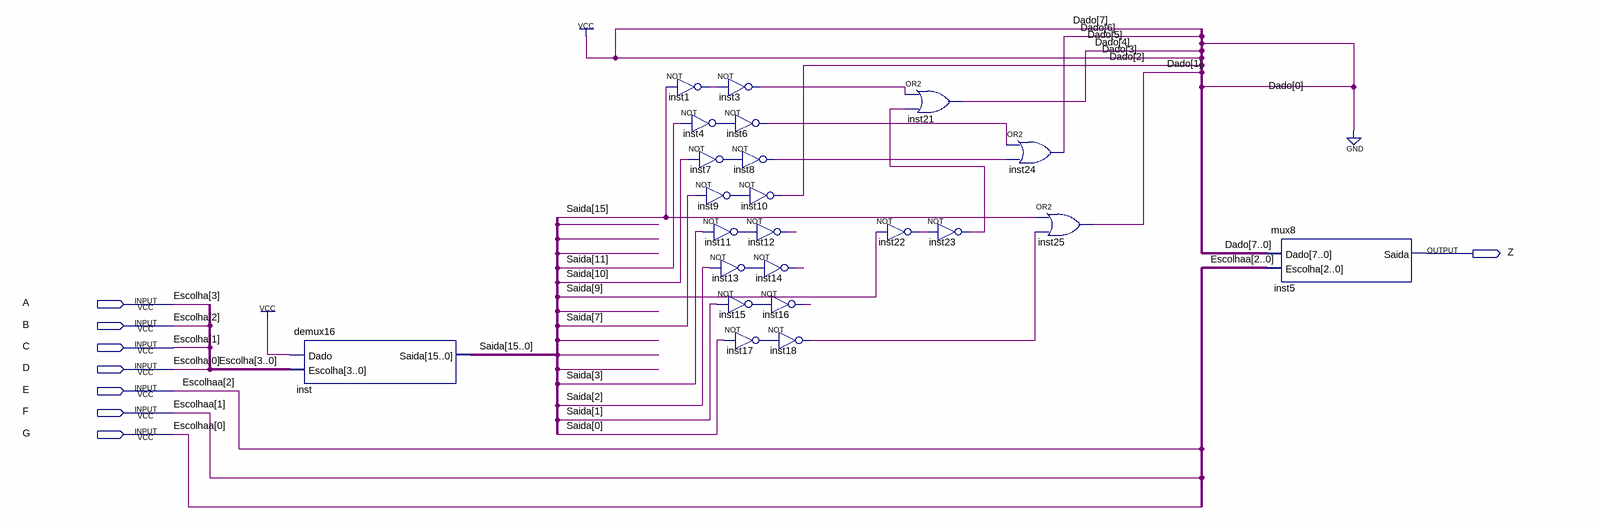
[diagram p0: schematic sheet]
// Quartus schematic lab63.bdf as structural Verilog: 23 symbols, 8 pins
module lab63 (
  input  A,
  input  B,
  input  C,
  input  D,
  input  E,
  input  F,
  input  G,
  output Z
);

  wire inst1_out, inst3_out, inst4_out, inst6_out, inst7_out, inst8_out, inst9_out, inst11_out, inst12_out,
       inst13_out, inst14_out, inst15_out, inst16_out, inst17_out, inst18_out, inst22_out, inst23_out;
  wire [6:1] Dado;
  wire [15:0] Saida;

  demux16 inst (.Dado(1'b1), .Escolha({A, B, C, D}), .Saida(Saida));
  not inst1 (inst1_out, Saida[15]);
  not inst4 (inst4_out, Saida[11]);
  not inst3 (inst3_out, inst1_out);
  not inst6 (inst6_out, inst4_out);
  not inst7 (inst7_out, Saida[10]);
  not inst8 (inst8_out, inst7_out);
  not inst9 (inst9_out, Saida[7]);
  not inst10 (Dado[2], inst9_out);
  not inst11 (inst11_out, Saida[3]);
  not inst13 (inst13_out, Saida[2]);
  not inst15 (inst15_out, Saida[1]);
  not inst17 (inst17_out, Saida[0]);
  not inst12 (inst12_out, inst11_out);
  not inst14 (inst14_out, inst13_out);
  not inst16 (inst16_out, inst15_out);
  not inst18 (inst18_out, inst17_out);
  or inst21 (Dado[4], inst3_out, inst23_out);
  not inst22 (inst22_out, Saida[9]);
  not inst23 (inst23_out, inst22_out);
  or inst24 (Dado[6], inst6_out, inst8_out);
  or inst25 (Dado[1], Saida[15], inst18_out);
  mux8 inst5 (.Dado({1'b1, Dado[6], 1'b0, Dado[4], 1'b1, Dado[2:1], 1'b0}), .Escolha({E, F, G}), .Saida(Z));

  // Other names for the same wires on the sheet: Escolha[3:0] = {A, B, C, D}; Escolhaa[2:0] = {E, F, G}
endmodule
